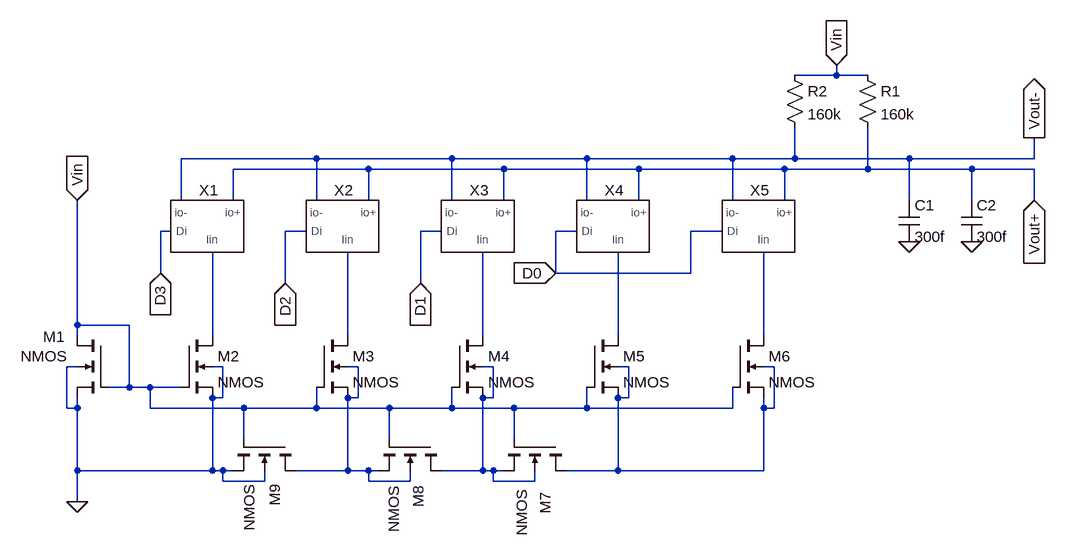
[diagram p0: schematic 4_Bit_DACV1.asc]
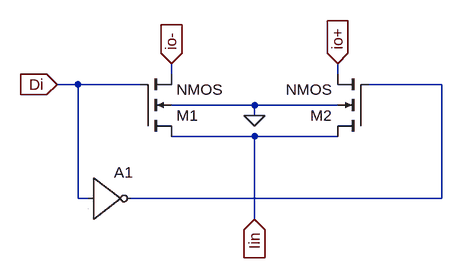
[diagram p1: sub-circuit differentialinput.asc]
4_Bit_DACV1.asc, the LTspice schematic file:
Version 4
SHEET 1 1652 696
WIRE 1216 -80 1216 -96
WIRE 1216 -80 1152 -80
WIRE 1264 -80 1216 -80
WIRE 416 48 208 48
WIRE 624 48 416 48
WIRE 832 48 624 48
WIRE 1056 48 832 48
WIRE 1152 48 1152 0
WIRE 1152 48 1056 48
WIRE 1328 48 1152 48
WIRE 1520 48 1520 16
WIRE 1520 48 1328 48
WIRE 496 64 288 64
WIRE 704 64 496 64
WIRE 912 64 704 64
WIRE 1136 64 912 64
WIRE 1264 64 1264 0
WIRE 1264 64 1136 64
WIRE 1424 64 1264 64
WIRE 1520 64 1424 64
WIRE 208 112 208 48
WIRE 288 112 288 64
WIRE 416 112 416 48
WIRE 496 112 496 64
WIRE 624 112 624 48
WIRE 704 112 704 64
WIRE 832 112 832 48
WIRE 912 112 912 64
WIRE 1056 112 1056 48
WIRE 1136 112 1136 64
WIRE 1328 112 1328 48
WIRE 1424 112 1424 64
WIRE 1520 112 1520 64
WIRE 192 160 176 160
WIRE 400 160 368 160
WIRE 608 160 576 160
WIRE 816 160 784 160
WIRE 1040 160 992 160
WIRE 176 224 176 160
WIRE 784 224 784 160
WIRE 992 224 992 160
WIRE 992 224 784 224
WIRE 368 240 368 160
WIRE 576 240 576 160
WIRE 48 304 48 112
WIRE 128 304 48 304
WIRE 48 320 48 304
WIRE 256 320 256 192
WIRE 464 320 464 192
WIRE 672 320 672 192
WIRE 880 320 880 192
WIRE 1104 320 1104 192
WIRE 48 368 32 368
WIRE 272 368 256 368
WIRE 480 368 464 368
WIRE 688 368 672 368
WIRE 896 368 880 368
WIRE 1120 368 1104 368
WIRE 128 400 128 304
WIRE 128 400 96 400
WIRE 160 400 128 400
WIRE 208 400 160 400
WIRE 272 416 272 368
WIRE 272 416 256 416
WIRE 480 416 480 368
WIRE 480 416 464 416
WIRE 688 416 688 368
WIRE 688 416 672 416
WIRE 896 416 896 368
WIRE 896 416 880 416
WIRE 32 432 32 368
WIRE 48 432 48 416
WIRE 48 432 32 432
WIRE 160 432 160 400
WIRE 304 432 160 432
WIRE 416 432 416 400
WIRE 416 432 304 432
WIRE 528 432 416 432
WIRE 624 432 624 400
WIRE 624 432 528 432
WIRE 720 432 624 432
WIRE 832 432 832 400
WIRE 832 432 720 432
WIRE 1056 432 1056 400
WIRE 1056 432 832 432
WIRE 1104 432 1104 416
WIRE 1120 432 1120 368
WIRE 1120 432 1104 432
WIRE 304 480 304 432
WIRE 528 480 528 432
WIRE 720 480 720 432
WIRE 48 528 48 432
WIRE 256 528 256 416
WIRE 256 528 48 528
WIRE 272 528 256 528
WIRE 288 528 272 528
WIRE 464 528 464 416
WIRE 464 528 384 528
WIRE 496 528 464 528
WIRE 512 528 496 528
WIRE 672 528 672 416
WIRE 672 528 608 528
WIRE 688 528 672 528
WIRE 704 528 688 528
WIRE 880 528 880 416
WIRE 880 528 800 528
WIRE 1104 528 1104 432
WIRE 1104 528 880 528
WIRE 272 544 272 528
WIRE 336 544 336 528
WIRE 336 544 272 544
WIRE 496 544 496 528
WIRE 560 544 560 528
WIRE 560 544 496 544
WIRE 688 544 688 528
WIRE 752 544 752 528
WIRE 752 544 688 544
WIRE 48 576 48 528
FLAG 784 224 D0
IOPIN 784 224 In
FLAG 576 240 D1
IOPIN 576 240 In
FLAG 368 240 D2
IOPIN 368 240 In
FLAG 176 224 D3
IOPIN 176 224 In
FLAG 1328 176 0
FLAG 1424 176 0
FLAG 1520 16 Vout-
IOPIN 1520 16 Out
FLAG 1520 112 Vout+
IOPIN 1520 112 In
FLAG 48 576 0
FLAG 48 112 Vin
IOPIN 48 112 In
FLAG 1216 -96 Vin
IOPIN 1216 -96 In
SYMBOL nmos4 96 320 M0
WINDOW 0 67 2 Left 2
WINDOW 3 63 32 Left 2
SYMATTR InstName M1
SYMATTR Value2 l=45n w=250n
SYMBOL nmos4 208 320 R0
SYMATTR InstName M2
SYMATTR Value2 l=45n w=200n
SYMBOL nmos4 416 320 R0
SYMATTR InstName M3
SYMATTR Value2 l=45n w=350n
SYMBOL nmos4 624 320 R0
SYMATTR InstName M4
SYMATTR Value2 l=45n w=350n
SYMBOL nmos4 832 320 R0
SYMATTR InstName M5
SYMATTR Value2 l=45n w=350n
SYMBOL nmos4 1056 320 R0
SYMATTR InstName M6
SYMATTR Value2 l=45n w=350n
SYMBOL nmos4 800 480 R90
WINDOW 0 81 32 Left 2
WINDOW 3 77 68 Left 2
SYMATTR InstName M7
SYMATTR Value2 l=45n w=300n
SYMBOL nmos4 608 480 R90
WINDOW 0 71 35 Left 2
WINDOW 3 71 73 Left 2
SYMATTR InstName M8
SYMATTR Value2 l=45n w=300n
SYMBOL nmos4 384 480 R90
WINDOW 0 69 32 Left 2
WINDOW 3 69 71 Left 2
SYMATTR InstName M9
SYMATTR Value2 l=45n w=300n
SYMBOL DifferentialInput 224 176 R0
SYMATTR InstName X1
SYMBOL DifferentialInput 432 176 R0
SYMATTR InstName X2
SYMBOL DifferentialInput 640 176 R0
SYMATTR InstName X3
SYMBOL DifferentialInput 848 176 R0
SYMATTR InstName X4
SYMBOL DifferentialInput 1072 176 R0
SYMATTR InstName X5
SYMBOL cap 1312 112 R0
SYMATTR InstName C1
SYMATTR Value 300f
SYMBOL cap 1408 112 R0
SYMATTR InstName C2
SYMATTR Value 300f
SYMBOL res 1248 -96 R0
SYMATTR InstName R1
SYMATTR Value 160k
SYMBOL res 1136 -96 R0
SYMATTR InstName R2
SYMATTR Value 160k

differentialinput.asc, the sub-circuit schematic file:
Version 4
SHEET 1 880 680
WIRE 192 32 192 16
WIRE 448 32 448 16
WIRE 48 48 16 48
WIRE 144 48 48 48
WIRE 608 48 496 48
WIRE 320 80 192 80
WIRE 448 80 320 80
WIRE 320 96 320 80
WIRE 320 128 192 128
WIRE 448 128 320 128
WIRE 48 224 48 48
WIRE 64 224 48 224
WIRE 608 224 608 48
WIRE 608 224 128 224
WIRE 320 256 320 128
FLAG 320 96 0
FLAG 16 48 Di
IOPIN 16 48 In
FLAG 320 256 Iin
IOPIN 320 256 In
FLAG 192 16 io-
IOPIN 192 16 In
FLAG 448 16 io+
IOPIN 448 16 In
SYMBOL Digital\\inv 64 160 R0
SYMATTR InstName A1
SYMBOL nmos4 144 128 M180
SYMATTR InstName M1
SYMATTR Value2 l=45n w=120n
SYMBOL nmos4 496 128 R180
SYMATTR InstName M2
SYMATTR Value2 l=120n w=45n

The netlist it stands for:
* 4_Bit_DACV1.asc
M1 Vin Vin 0 0 NMOS l=45n w=250n
M2 N001 Vin 0 0 NMOS l=45n w=200n
M3 N002 Vin N006 N006 NMOS l=45n w=350n
M4 N003 Vin N007 N007 NMOS l=45n w=350n
M5 N004 Vin N008 N008 NMOS l=45n w=350n
M6 N005 Vin N008 N008 NMOS l=45n w=350n
M7 N008 Vin N007 N007 NMOS l=45n w=300n
M8 N007 Vin N006 N006 NMOS l=45n w=300n
M9 N006 Vin 0 0 NMOS l=45n w=300n
XX1 D3 N001 Vout+ Vout- differentialinput
XX2 D2 N002 Vout+ Vout- differentialinput
XX3 D1 N003 Vout+ Vout- differentialinput
XX4 D0 N004 Vout+ Vout- differentialinput
XX5 D0 N005 Vout+ Vout- differentialinput
C1 Vout- 0 300f
C2 Vout+ 0 300f
R1 Vin Vout+ 160k
R2 Vin Vout- 160k

* block symbol definitions
.subckt differentialinput Di Iin io+ io-
A1 Di 0 0 0 0 N001 0 0 BUF
M1 Iin Di io- 0 NMOS l=45n w=120n
M2 Iin N001 io+ 0 NMOS l=120n w=45n
.ends differentialinput

.model NMOS NMOS
.model PMOS PMOS
.lib standard.mos
.backanno
.end